# Altium schematic sheet Regulator.SchDoc
size B
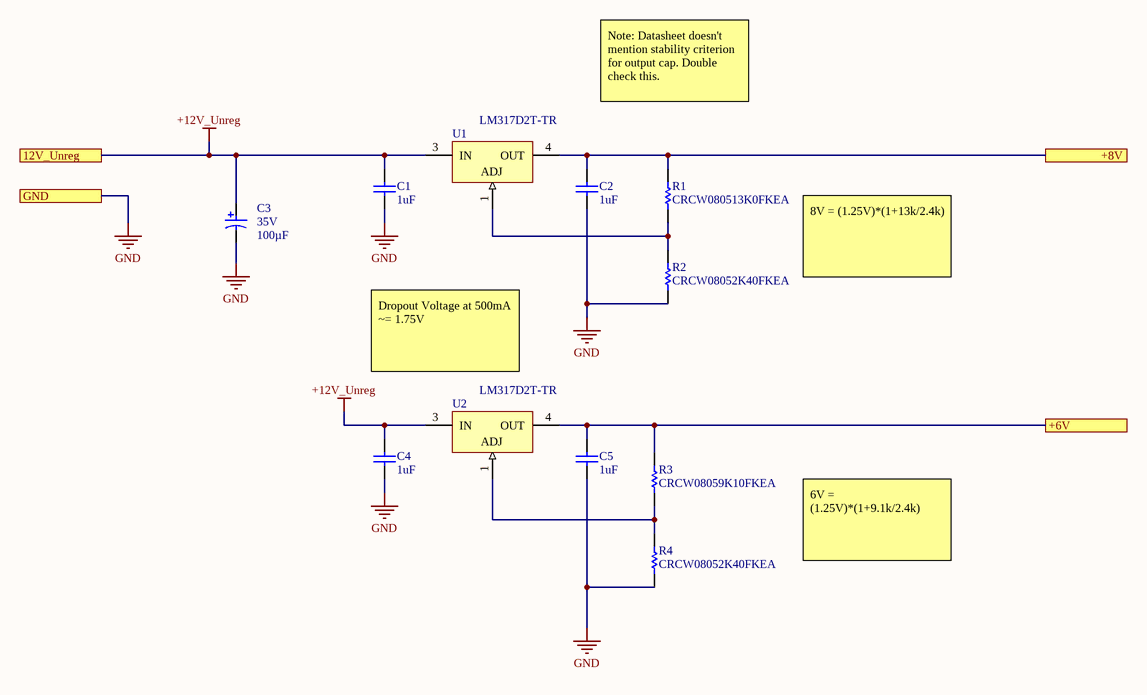
[diagram p0: Regulator.SchDoc]

## Parts
C1  1uF  [CAPC2013X100X50NL20T25]
C2  1uF  [CAPC2013X100X50NL20T25]
C3  Capacitance: 100µF  Voltage Rating: 35V  [PNSC-FC-V-G_V]  (hidden comment: EEEFC1V101P)
C4  1uF  [CAPC2013X100X50NL20T25]
C5  1uF  [CAPC2013X100X50NL20T25]
R1  CRCW080513K0FKEA  [RESC2013X50X30LL20T20]
R2  CRCW08052K40FKEA  [RESC2013X50X30NL20T20]
R3  CRCW08059K10FKEA  [RESC2013X50X30ML20T20]
R4  CRCW08052K40FKEA  [RESC2013X50X30NL20T20]
U1  LM317D2T-TR  [TO-263_N]
U2  LM317D2T-TR  [TO-263_N]

## Ports
12V_Unreg, +6V, +8V, GND

## Nets
+12V_Unreg: C1.2 C3.1 C4.2 U1.3(IN) U2.3(IN) ; port 12V_Unreg
GND: C1.1 C2.1 C3.2 C4.1 C5.1 R2.2 R4.2 ; port GND
+6V: C5.2 R3.2 U2.4(OUT) ; port +6V
+8V: C2.2 R1.2 U1.4(OUT) ; port +8V
NetR1_1: R1.1 R2.1 U1.1(ADJ)
NetR3_1: R3.1 R4.1 U2.1(ADJ)

## Notes on the sheet
- Note: Datasheet doesn't mention stability criterion for output cap. Double check this.
- 8V = (1.25V)*(1+13k/2.4k)
- Dropout Voltage at 500mA ~= 1.75V
- 6V = (1.25V)*(1+9.1k/2.4k)

## Library data of the parts
C1 C2 C4 C5 = CMP-2007-03716-1: Part Number: C0805X105K3RACTU; Manufacturer: Kemet
C3 = CMP-2000-06202-1: Aluminum Electrolytic Capacitor, 100 uF, +/- 20%, 35 V, 2-Pin SMD (Size Code G), -40 to 105 degC, RoHS, Tape and Reel; Manufacturer: Panasonic; Impedance Frequency: 100kHz; Power Factor Frequency: 120Hz; Life Time @ Temperature: 1000hours@105°C; Ripple Current Temperature: 105°C; Capacitor Case Style: RadialCan-SMD; SVHC: ToBeAdvised; Operating Lifetime: 1000h; Lead Cross-section Width: 0.9mm; Power Factor: 0.12; Impedance: 0.4ohm; Product Range: PANASONIC-FCSeries; Ripple Current AC: 220mA; Power Factor Temperature: 20°C; External Width: 10.3mm; External Length / Height: 10.2mm; Tolerance +: 20%; Operating Temperature Min: -40°C; Diameter: 10mm; Height: 10.2mm; Tolerance -: 20%; Package Reference: FC-V-G; Manufacturer URL: http://www.panasonic.com/; Capacitance Tolerance: ±20%; Tape Width: 16mm; Packaging: CutTape; Datasheet URL: http://industrial.panasonic.com/cdbs/www-data/pdf/RDE0000/ABA0000C1172.pdf; Package URL: http://industrial.panasonic.com/cdbs/www-data/pdf/RDE0000/DME0000COL48.pdf; Operating Temperature Range: -40°Cto+105°C; Operating Temperature Max: 105°C; Ripple Current Frequency: 100kHz; Datasheet Version: 03/2016; Package / Case: G; Series: FC; Lifetime @ Temperature: 1000hours@105°C; Mounting Technology: SurfaceMount; AE Capacitor Case: RadialCan-SMD; Impedance Temperature: 20°C; Package Description: 2-Pin Electrolytic Aluminum Capacitor, Body 10.3 x 10.3 mm; Operating life Time: 1000h; Capacitance Tolerance ±: ±20%; Voltage Rating V DC: 35V; MSL: (NotAvailable)
R1 = CMP-2001-04945-1: Manufacturer: Vishay Dale; Part Number: CRCW080513K0FKEA
R2 R4 = CMP-2001-03768-1: Manufacturer: Vishay Dale; Part Number: CRCW08052K40FKEA
R3 = CMP-2001-04176-1: Manufacturer: Vishay Dale; Part Number: CRCW08059K10FKEA
U1 U2 = CMP-0244-00094-1: 1.5A, 1.2V to 37V Adjustable Voltage Regulator, 3-Pin D2PAK, Tape and Reel; DatasheetVersion: 1/11/2011; PackageVersion: 2011; PackageDescription: 3-Pin Transistor Outline Package 2.54 mm Pitch, 15.4 mm Lead Span (D2PAK); ComponentLink2URL: http://www.st.com/internet/com/TECHNICAL_RESOURCES/TECHNICAL_LITERATURE/DATASHEET/CD00000455.pdf; PackageReference: TO-263; ComponentLink1Description: Manufacturer URL; ComponentLink2Description: Datasheet; ComponentLink1URL: http://www.st.com